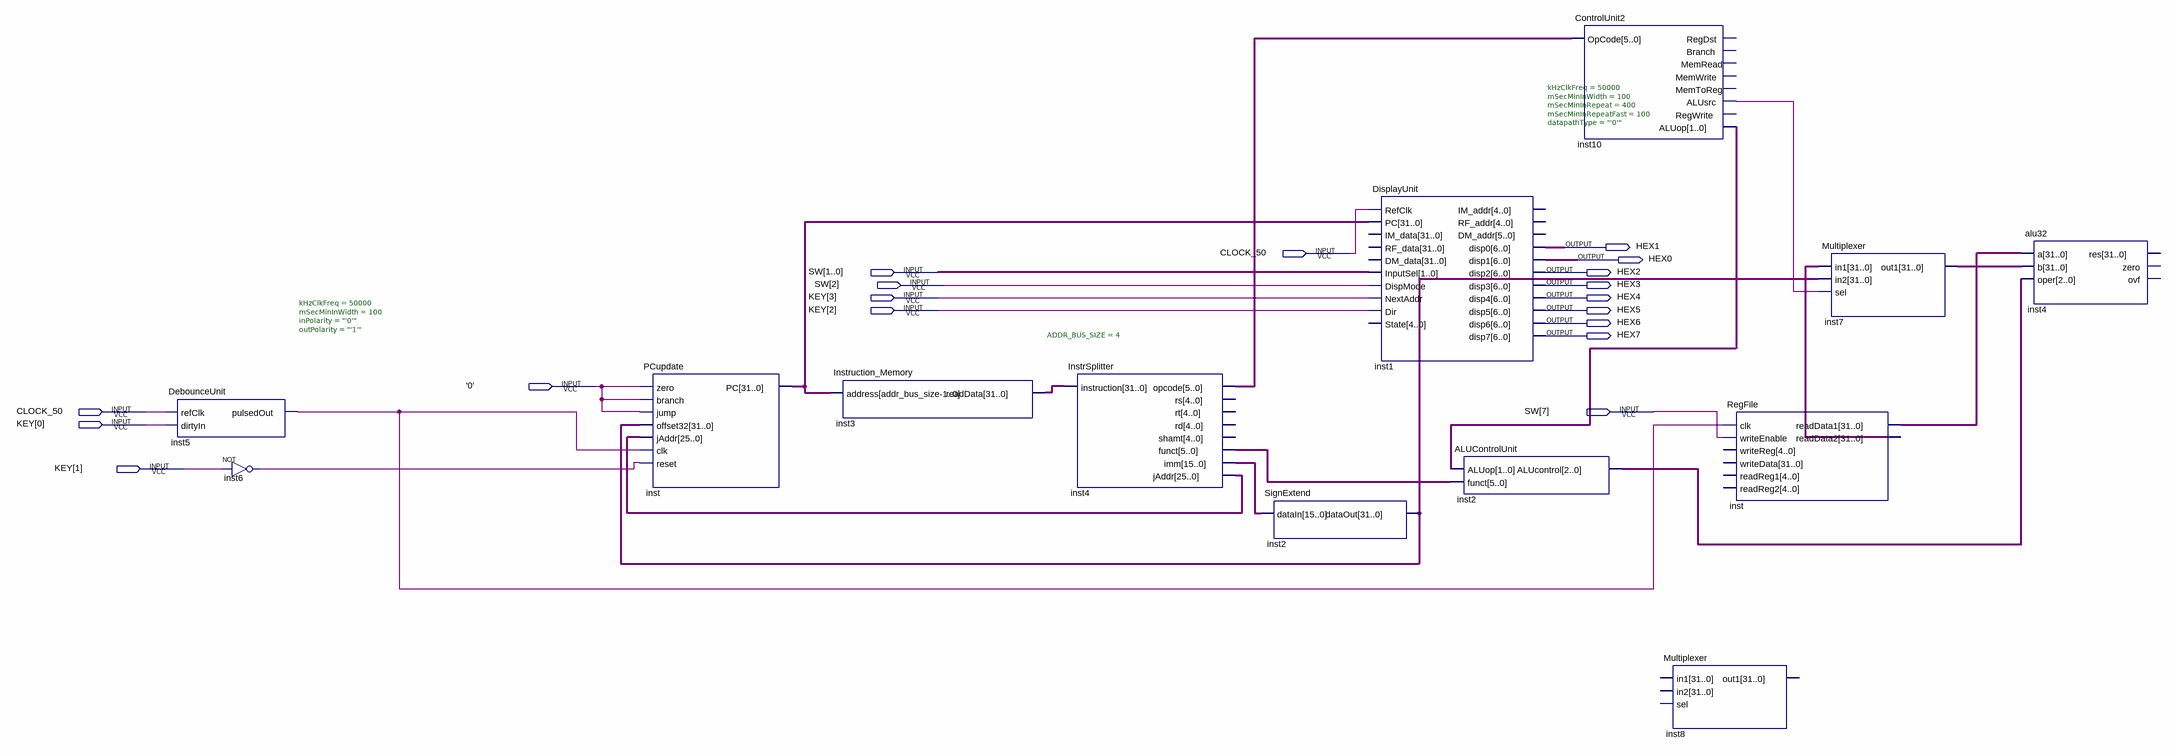
[diagram p0: schematic sheet]
// Quartus schematic mips_single_cycle.bdf as structural Verilog: 13 symbols, 18 pins
module mips_single_cycle (
  input  CLOCK_50,
  input  [7:0] SW,
  input  [3:0] KEY,
  input  \'0' ,
  output HEX1,
  output HEX0,
  output HEX2,
  output HEX3,
  output HEX4,
  output HEX5,
  output HEX6,
  output HEX7
);

  wire inst5_pulsedout, inst6_out, inst10_alusrc;
  wire [1:0] inst10_aluop;
  wire [2:0] inst2_alucontrol;
  wire [5:0] inst4_funct, inst4_opcode;
  wire [6:0] inst1_disp0, inst1_disp1;
  wire [15:0] inst4_imm;
  wire [25:0] inst4_jaddr;
  wire [31:0] inst2_dataout, inst3_readdata, inst7_out1, inst_pc, inst_readdata1, inst_readdata2;

  DebounceUnit #(.kHzClkFreq(50000), .mSecMinInWidth(100), .inPolarity("'0'"), .outPolarity("'1'")) inst5 (
    .refClk(CLOCK_50), .dirtyIn(KEY[0]), .pulsedOut(inst5_pulsedout));
  not inst6 (inst6_out, KEY[1]);
  PCupdate inst (
    .zero(\'0' ), .branch(\'0' ), .jump(\'0' ), .offset32(inst2_dataout), .jAddr(inst4_jaddr),
    .clk(inst5_pulsedout), .reset(inst6_out), .PC(inst_pc));
  Instruction_Memory #(.ADDR_BUS_SIZE(4)) inst3 (.address(inst_pc), .readData(inst3_readdata));
  InstrSplitter inst4 (
    .instruction(inst3_readdata), .opcode(inst4_opcode), .funct(inst4_funct), .imm(inst4_imm),
    .jAddr(inst4_jaddr));  // open: rs, rt, rd, shamt
  SignExtend inst2 (.dataIn(inst4_imm), .dataOut(inst2_dataout));
  DisplayUnit #(.kHzClkFreq(50000), .mSecMinInWidth(100), .mSecMinInRepeat(400), .mSecMinInRepeatFast(100), .datapathType("'0'")) inst1 (
    .RefClk(CLOCK_50), .PC(inst_pc), .InputSel(SW[1:0]), .DispMode(SW[2]), .NextAddr(KEY[3]), .Dir(KEY[2]),
    .disp0(inst1_disp0), .disp1(inst1_disp1), .disp2(HEX2), .disp3(HEX3), .disp4(HEX4), .disp5(HEX5),
    .disp6(HEX6), .disp7(HEX7));  // open: IM_data, RF_data, DM_data, State, IM_addr, RF_addr, DM_addr
  ALUControlUnit inst2_dup2 (.ALUop(inst10_aluop), .funct(inst4_funct), .ALUcontrol(inst2_alucontrol));
  ControlUnit2 inst10 (
    .OpCode(inst4_opcode), .ALUsrc(inst10_alusrc), .ALUop(inst10_aluop));  // open: RegDst, Branch, MemRead, MemWrite, MemToReg, RegWrite
  Multiplexer inst8 ();  // open: in1, in2, sel, out1
  RegFile inst_dup2 (
    .clk(inst5_pulsedout), .writeEnable(SW[7]), .readData1(inst_readdata1), .readData2(inst_readdata2));  // open: writeReg, writeData, readReg1, readReg2
  Multiplexer inst7 (.in1(inst_readdata2), .in2(inst2_dataout), .sel(inst10_alusrc), .out1(inst7_out1));
  alu32 inst4_dup2 (.a(inst_readdata1), .b(inst7_out1), .oper(inst2_alucontrol));  // open: res, zero, ovf
endmodule
